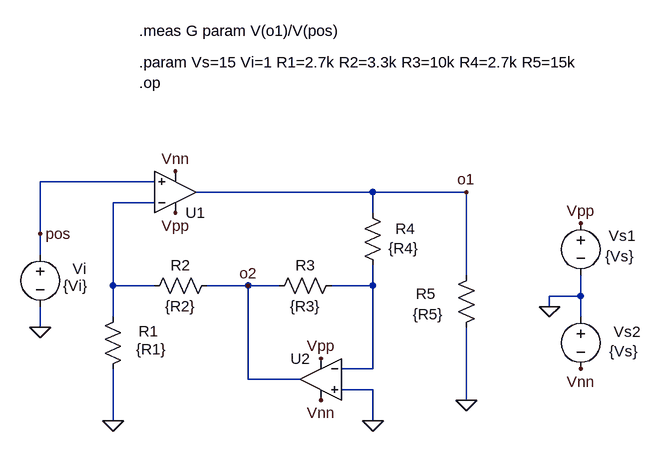
[diagram p0: schematic Amp08op.asc]
Amp08op.asc, the LTspice schematic file:
Version 4
SHEET 1 968 680
WIRE -256 160 -432 160
WIRE 80 176 -192 176
WIRE 224 176 80 176
WIRE -256 192 -320 192
WIRE 80 208 80 176
WIRE -432 240 -432 160
WIRE -432 272 -432 240
WIRE 224 304 224 176
WIRE -320 320 -320 192
WIRE -256 320 -320 320
WIRE -112 320 -176 320
WIRE -64 320 -112 320
WIRE 80 320 80 288
WIRE 80 320 16 320
WIRE 400 336 400 304
WIRE 400 336 352 336
WIRE 352 352 352 336
WIRE -320 368 -320 320
WIRE 400 368 400 336
WIRE -432 384 -432 352
WIRE 80 448 80 320
WIRE 80 448 32 448
WIRE -112 464 -112 320
WIRE -32 464 -112 464
WIRE 80 480 32 480
WIRE 224 496 224 384
WIRE -320 528 -320 448
WIRE 80 528 80 480
FLAG 400 224 Vpp
FLAG 352 352 0
FLAG 400 448 Vnn
FLAG -224 208 Vpp
FLAG -224 144 Vnn
FLAG -432 384 0
FLAG 224 176 o1
FLAG -432 240 pos
FLAG 0 432 Vpp
FLAG 0 496 Vnn
FLAG 80 528 0
FLAG -320 528 0
FLAG 224 496 0
FLAG -112 320 o2
SYMBOL voltage 400 208 R0
WINDOW 123 0 0 Left 0
WINDOW 39 0 0 Left 0
WINDOW 0 43 35 Left 2
WINDOW 3 38 67 Left 2
SYMATTR InstName Vs1
SYMATTR Value {Vs}
SYMBOL voltage 400 352 R0
WINDOW 123 0 0 Left 0
WINDOW 39 0 0 Left 0
WINDOW 0 51 39 Left 2
WINDOW 3 44 69 Left 2
SYMATTR InstName Vs2
SYMATTR Value {Vs}
SYMBOL voltage -432 256 R0
WINDOW 3 35 64 Left 2
WINDOW 123 0 0 Left 0
WINDOW 39 0 0 Left 0
WINDOW 0 50 38 Left 2
SYMATTR Value {Vi}
SYMATTR InstName Vi
SYMBOL Opamps\\UniversalOpamp2 -224 176 M180
SYMATTR InstName U1
SYMBOL res -304 352 M0
WINDOW 0 -54 38 Left 2
WINDOW 3 -67 66 Left 2
SYMATTR InstName R1
SYMATTR Value {R1}
SYMBOL res -272 336 R270
WINDOW 0 32 56 VTop 2
WINDOW 3 0 56 VBottom 2
SYMATTR InstName R2
SYMATTR Value {R2}
SYMBOL res -80 336 R270
WINDOW 0 32 56 VTop 2
WINDOW 3 0 56 VBottom 2
SYMATTR InstName R3
SYMATTR Value {R3}
SYMBOL Opamps\\UniversalOpamp2 0 464 M0
SYMATTR InstName U2
SYMBOL res 64 192 R0
WINDOW 0 51 40 Left 2
WINDOW 3 40 70 Left 2
SYMATTR InstName R4
SYMATTR Value {R4}
SYMBOL res 240 288 M0
WINDOW 0 63 44 Left 2
WINDOW 3 51 76 Left 2
SYMATTR InstName R5
SYMATTR Value {R5}
TEXT -280 -24 Left 2 !.param Vs=15 Vi=1 R1=2.7k R2=3.3k R3=10k R4=2.7k R5=15k
TEXT -280 8 Left 2 !.op
TEXT -280 -72 Left 2 !.meas G param V(o1)/V(pos)

The netlist it stands for:
* Amp08op.asc
Vs1 Vpp 0 {Vs}
Vs2 0 Vnn {Vs}
Vi pos 0 {Vi}
XU1 pos N001 Vpp Vnn o1 level.2 Avol=1Meg GBW=10Meg Slew=10Meg ilimit=25m rail=0 Vos=0 phimargin=45 en=0 enk=0 in=0 ink=0 Rin=500Meg  ; pins IN+ IN- V+ V- OUT
R1 N001 0 {R1}
R2 N001 o2 {R2}
R3 o2 N002 {R3}
XU2 0 N002 Vpp Vnn o2 level.2 Avol=1Meg GBW=10Meg Slew=10Meg ilimit=25m rail=0 Vos=0 phimargin=45 en=0 enk=0 in=0 ink=0 Rin=500Meg  ; pins IN+ IN- V+ V- OUT
R4 o1 N002 {R4}
R5 o1 0 {R5}
.param Vs=15 Vi=1 R1=2.7k R2=3.3k R3=10k R4=2.7k R5=15k
.op
.meas G param V(o1)/V(pos)
.lib UniversalOpamps2.sub
.backanno
.end